# Altium schematic sheet Ethernet.SchDoc
size A3; PageSetup: Record=PageOptions|CenterHorizontal=True|CenterVertical=True|PrintScale=0.73|XCorrection=1.00|YCorrection=1.00|PrintKind=0|BorderSize=5000000|LeftOffset=0|BottomOffset=0|Orientation=2|PaperLength=1000|PaperWidth=1000|Scale=100|PaperSource=7|PrintQuality=-4|MediaType=1|DitherType=10|PaperKind=A4|PrintScaleMode=1; Date: 27.05.2014; DrawnBy: luths8; Organization: BFH; Address1: Bern University of Applied Sciences; Address2: Engineering and Information Technology; Address3: Jlcoweg 1; Address4: CH-3400 Burgdorf; DocumentNumber: 7; Revision: 1.0; SheetNumber: 7; SheetTotal: 16; CurrentDate: 27.05.2014
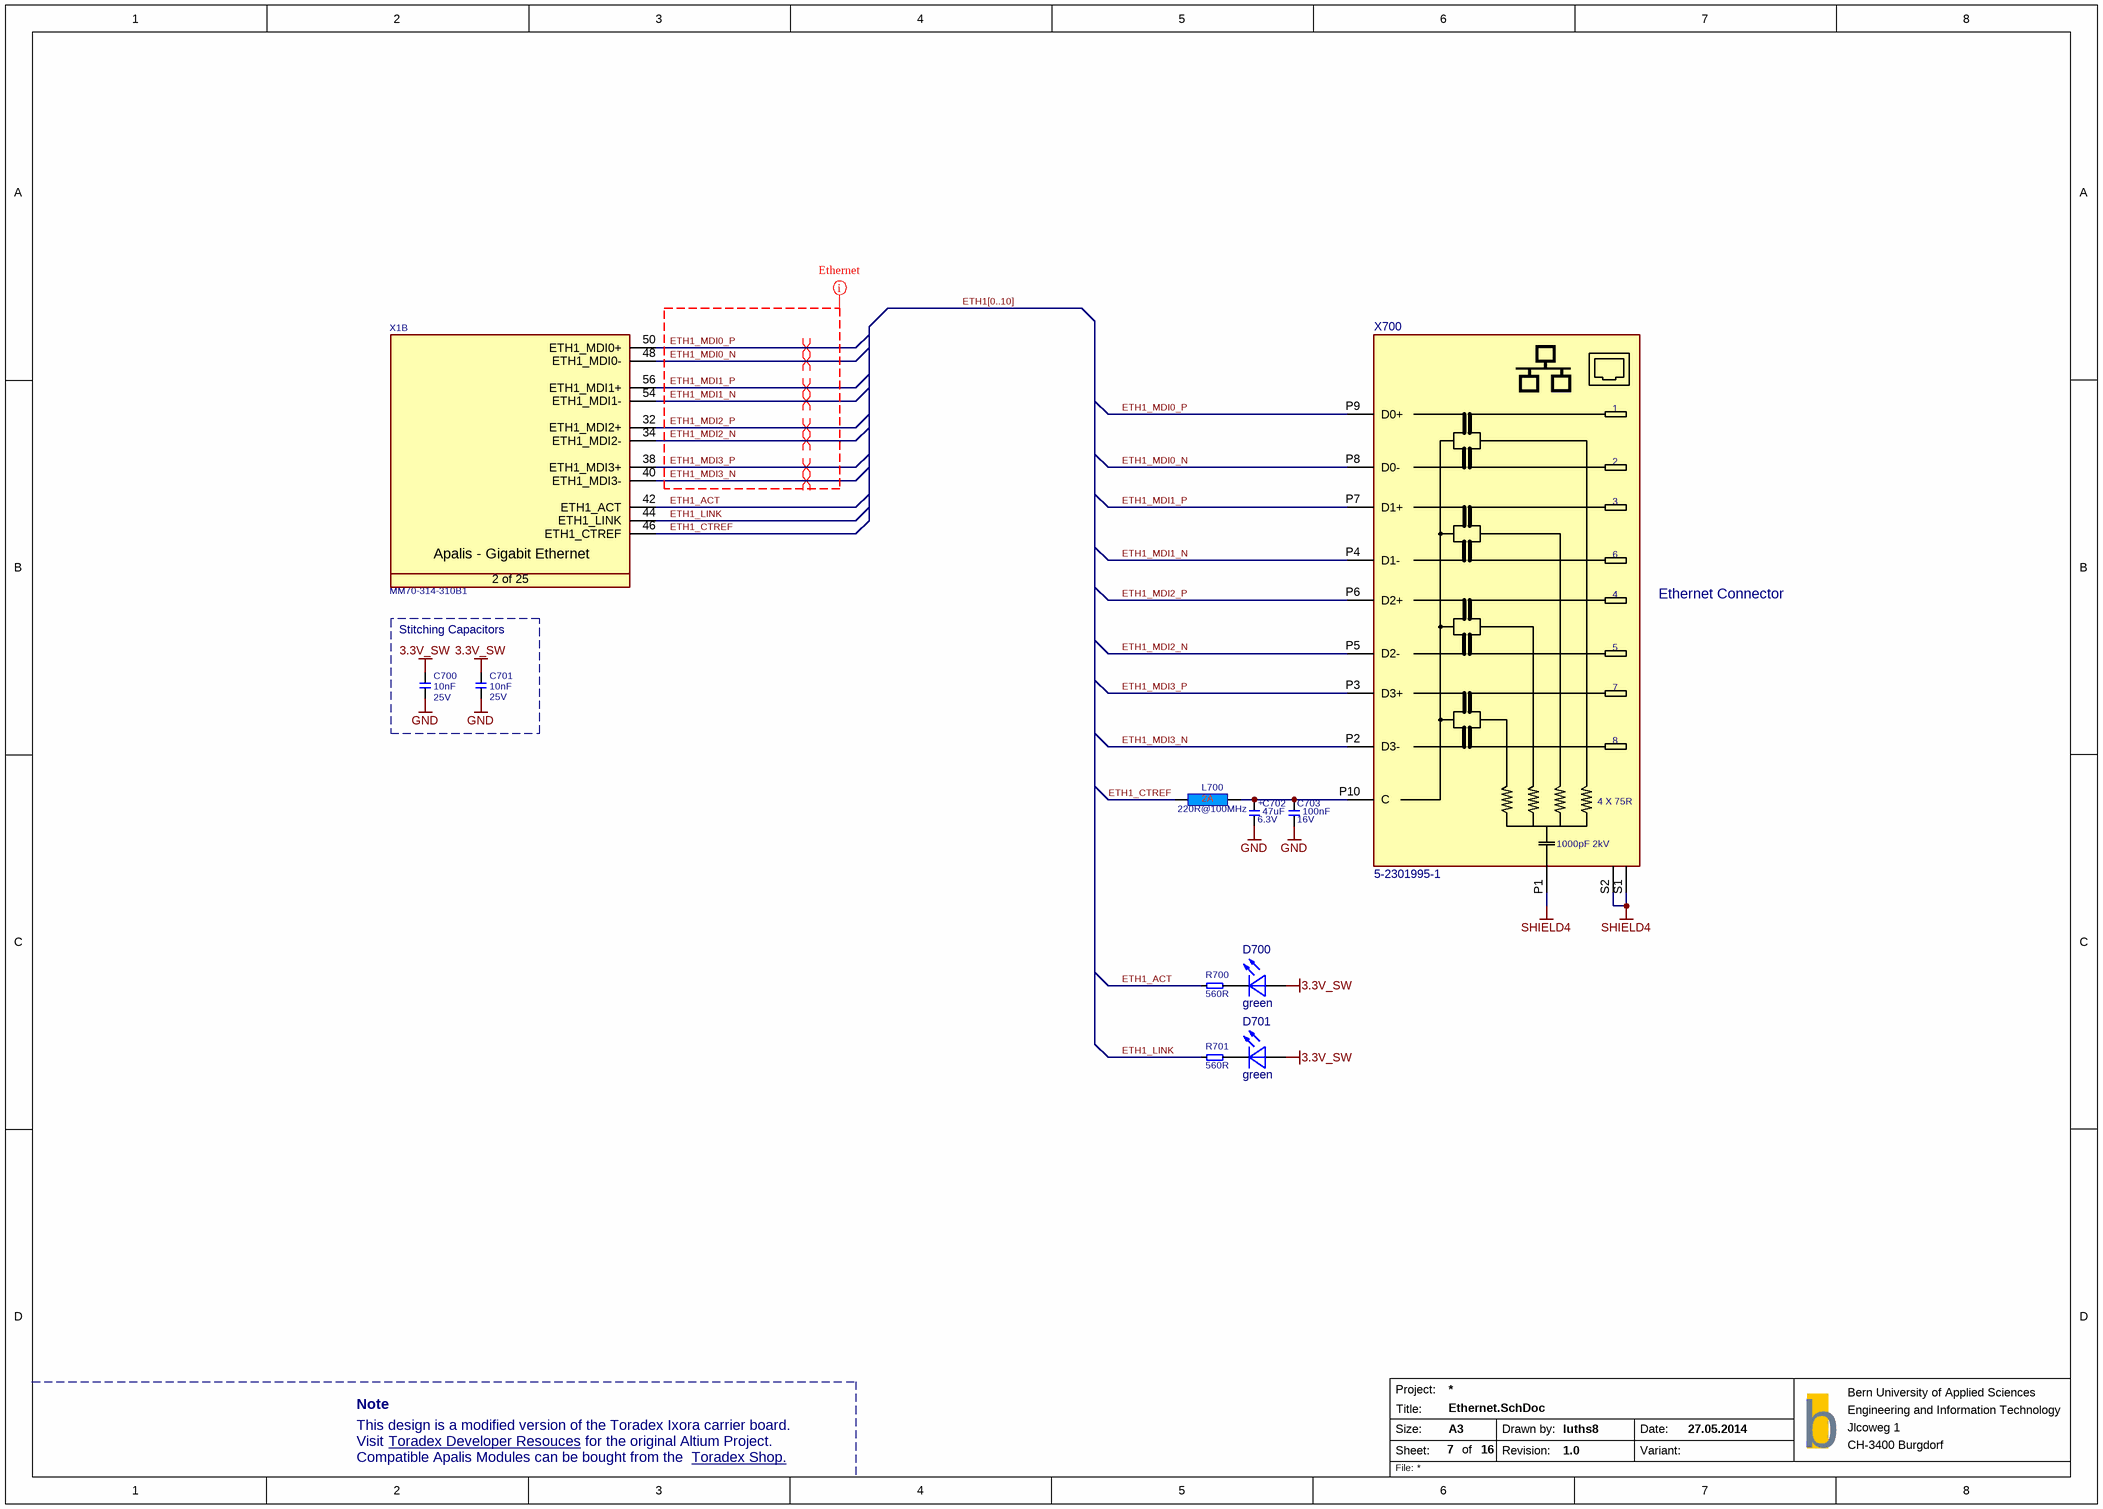
[diagram p0: Ethernet.SchDoc]

## Parts
C700  10nF  Rating: 25V  [SMD0603CAP]
C701  10nF  Rating: 25V  [SMD0603CAP]
C702  Rating: 6.3V  [T_CAPMP3216X180N]  (hidden comment: 47uF)
C703  Rating: 16V  [SMD0603CAP]  (hidden comment: 100nF)
D700  green  [LED]
D701  green  [LED]
L700  220R@100MHz  [INDC1608X95N]
R700  560R  [SMD0603RES]
R701  560R  [SMD0603RES]
X1  Manufacturer Part No.: MM70-314-310B1  [T_JAE_MM70-314-310B1]  (hidden comment: CON-JAE-MM70-314-310B1-314-0.5mm)  (part B of 25)
X700  5-2301995-1  [5-2301995-4]

## Blocks framed on the sheet
Stitching Capacitors: C700 C701

## Nets
3.3V_SW: C700.2 C701.2 D700.A D701.A
GND: C700.1 C701.1 C702.2 C703.1
SHIELD4: X700.P1(S) X700.S1(S) X700.S2(S)
ETH1_ACT: R700.1 X1.42(ETH1_ACT)
ETH1_CTREF: L700.1 X1.46(ETH1_CTREF)
ETH1_LINK: R701.1 X1.44(ETH1_LINK)
ETH1_MDI0_N: X1.48(ETH1_MDI0-) X700.P8(D0-)
ETH1_MDI0_P: X1.50(ETH1_MDI0+) X700.P9(D0+)
ETH1_MDI1_N: X1.54(ETH1_MDI1-) X700.P4(D1-)
ETH1_MDI1_P: X1.56(ETH1_MDI1+) X700.P7(D1+)
ETH1_MDI2_N: X1.34(ETH1_MDI2-) X700.P5(D2-)
ETH1_MDI2_P: X1.32(ETH1_MDI2+) X700.P6(D2+)
ETH1_MDI3_N: X1.40(ETH1_MDI3-) X700.P2(D3-)
ETH1_MDI3_P: X1.38(ETH1_MDI3+) X700.P3(D3+)
NetC702_1: C702.1 C703.2 L700.2 X700.P10(C)
NetD700_C: D700.C R700.2
NetD701_C: D701.C R701.2

## Buses and harness runs
bus ETH1[0..10]

## Layout directives
differential pair: ETH1_MDI0_N, ETH1_MDI0_P, ETH1_MDI1_N, ETH1_MDI1_P, ETH1_MDI2_N, ETH1_MDI2_P, ETH1_MDI3_N, ETH1_MDI3_P
net class Ethernet: ETH1_MDI0_N, ETH1_MDI0_P, ETH1_MDI1_N, ETH1_MDI1_P, ETH1_MDI2_N, ETH1_MDI2_P, ETH1_MDI3_N, ETH1_MDI3_P

## Notes on the sheet
- (near X700) Ethernet Connector
- Note
- This design is a modified version of the Toradex Ixora carrier board.
- Visit
- Compatible Apalis Modules can be bought from the
- Toradex Developer Resouces <https://developer.toradex.com/products/ixora-carrier-board>
- for the original Altium Project.
- Toradex Shop. <https://www.toradex.com/order-now/apalis-arm-family>
- Project:
- Size:
- Sheet:
- Title:
- A3
- of
- Drawn by:
- Revision:
- Date:
- Variant:
- b
- File:
- (in symbol C-TA-47uF-6.3V-20%-3216) +
- (in symbol CON-JAE-MM70-314-310B1-314-0.5mm, part B) Apalis - Gigabit Ethernet; 2 of 25
- (in symbol CON-TE-5-2301995-1) 1; 2; 3; 6; 4; 5; 7; 8; 4 X 75R; 1000pF 2kV

## Library data of the parts
C700 C701 = C-X7R-10nF-25V-10%-0603: Capacitor Ceramic X7R 10nF 25V 10% 0603; Tolerance: 10%; Type: X7R; Value: 10nF
C702 = C-TA-47uF-6.3V-20%-3216: Capacitor TA 47uF 6.3V 20% 3216; Tolerance: 20%; Type: TA; Value: 47uF
C703 = C-X7R-100nF-16V-10%-0402: Capacitor Ceramic X7R 100nF 16V 10% 0603; Tolerance: 10%; Type: X7R; Value: 100nF
D700 D701 = LED green: Manufacturer Part No.: LGM67KG1J224Z
L700 = L-220R@100MHz-2A-25%-0603: 220R@100MHz 2A EMI FILTER; Tolerance: 25%; Rating: 2A; Value: 220R@100MHz
R700 R701 = R-560R-63mW-5%-0402: Resistor 560 ohm 63mW 5% 0603; Rating: 63mW; Tolerance: 5%; Value: 560R
X1 = CON-JAE-MM70-314-310B1-314-0.5mm: MXM3 Connector; Manufacturer Name: JAE; No. of ways: 314
X700 = CON-TE-5-2301995-1: Vertical 10/100/1G Mag Jack; Manufacturer Part No.: 5-2301995-1